# Altium project ESE516_Shipwars.PrjPcb (part 1 of 2)
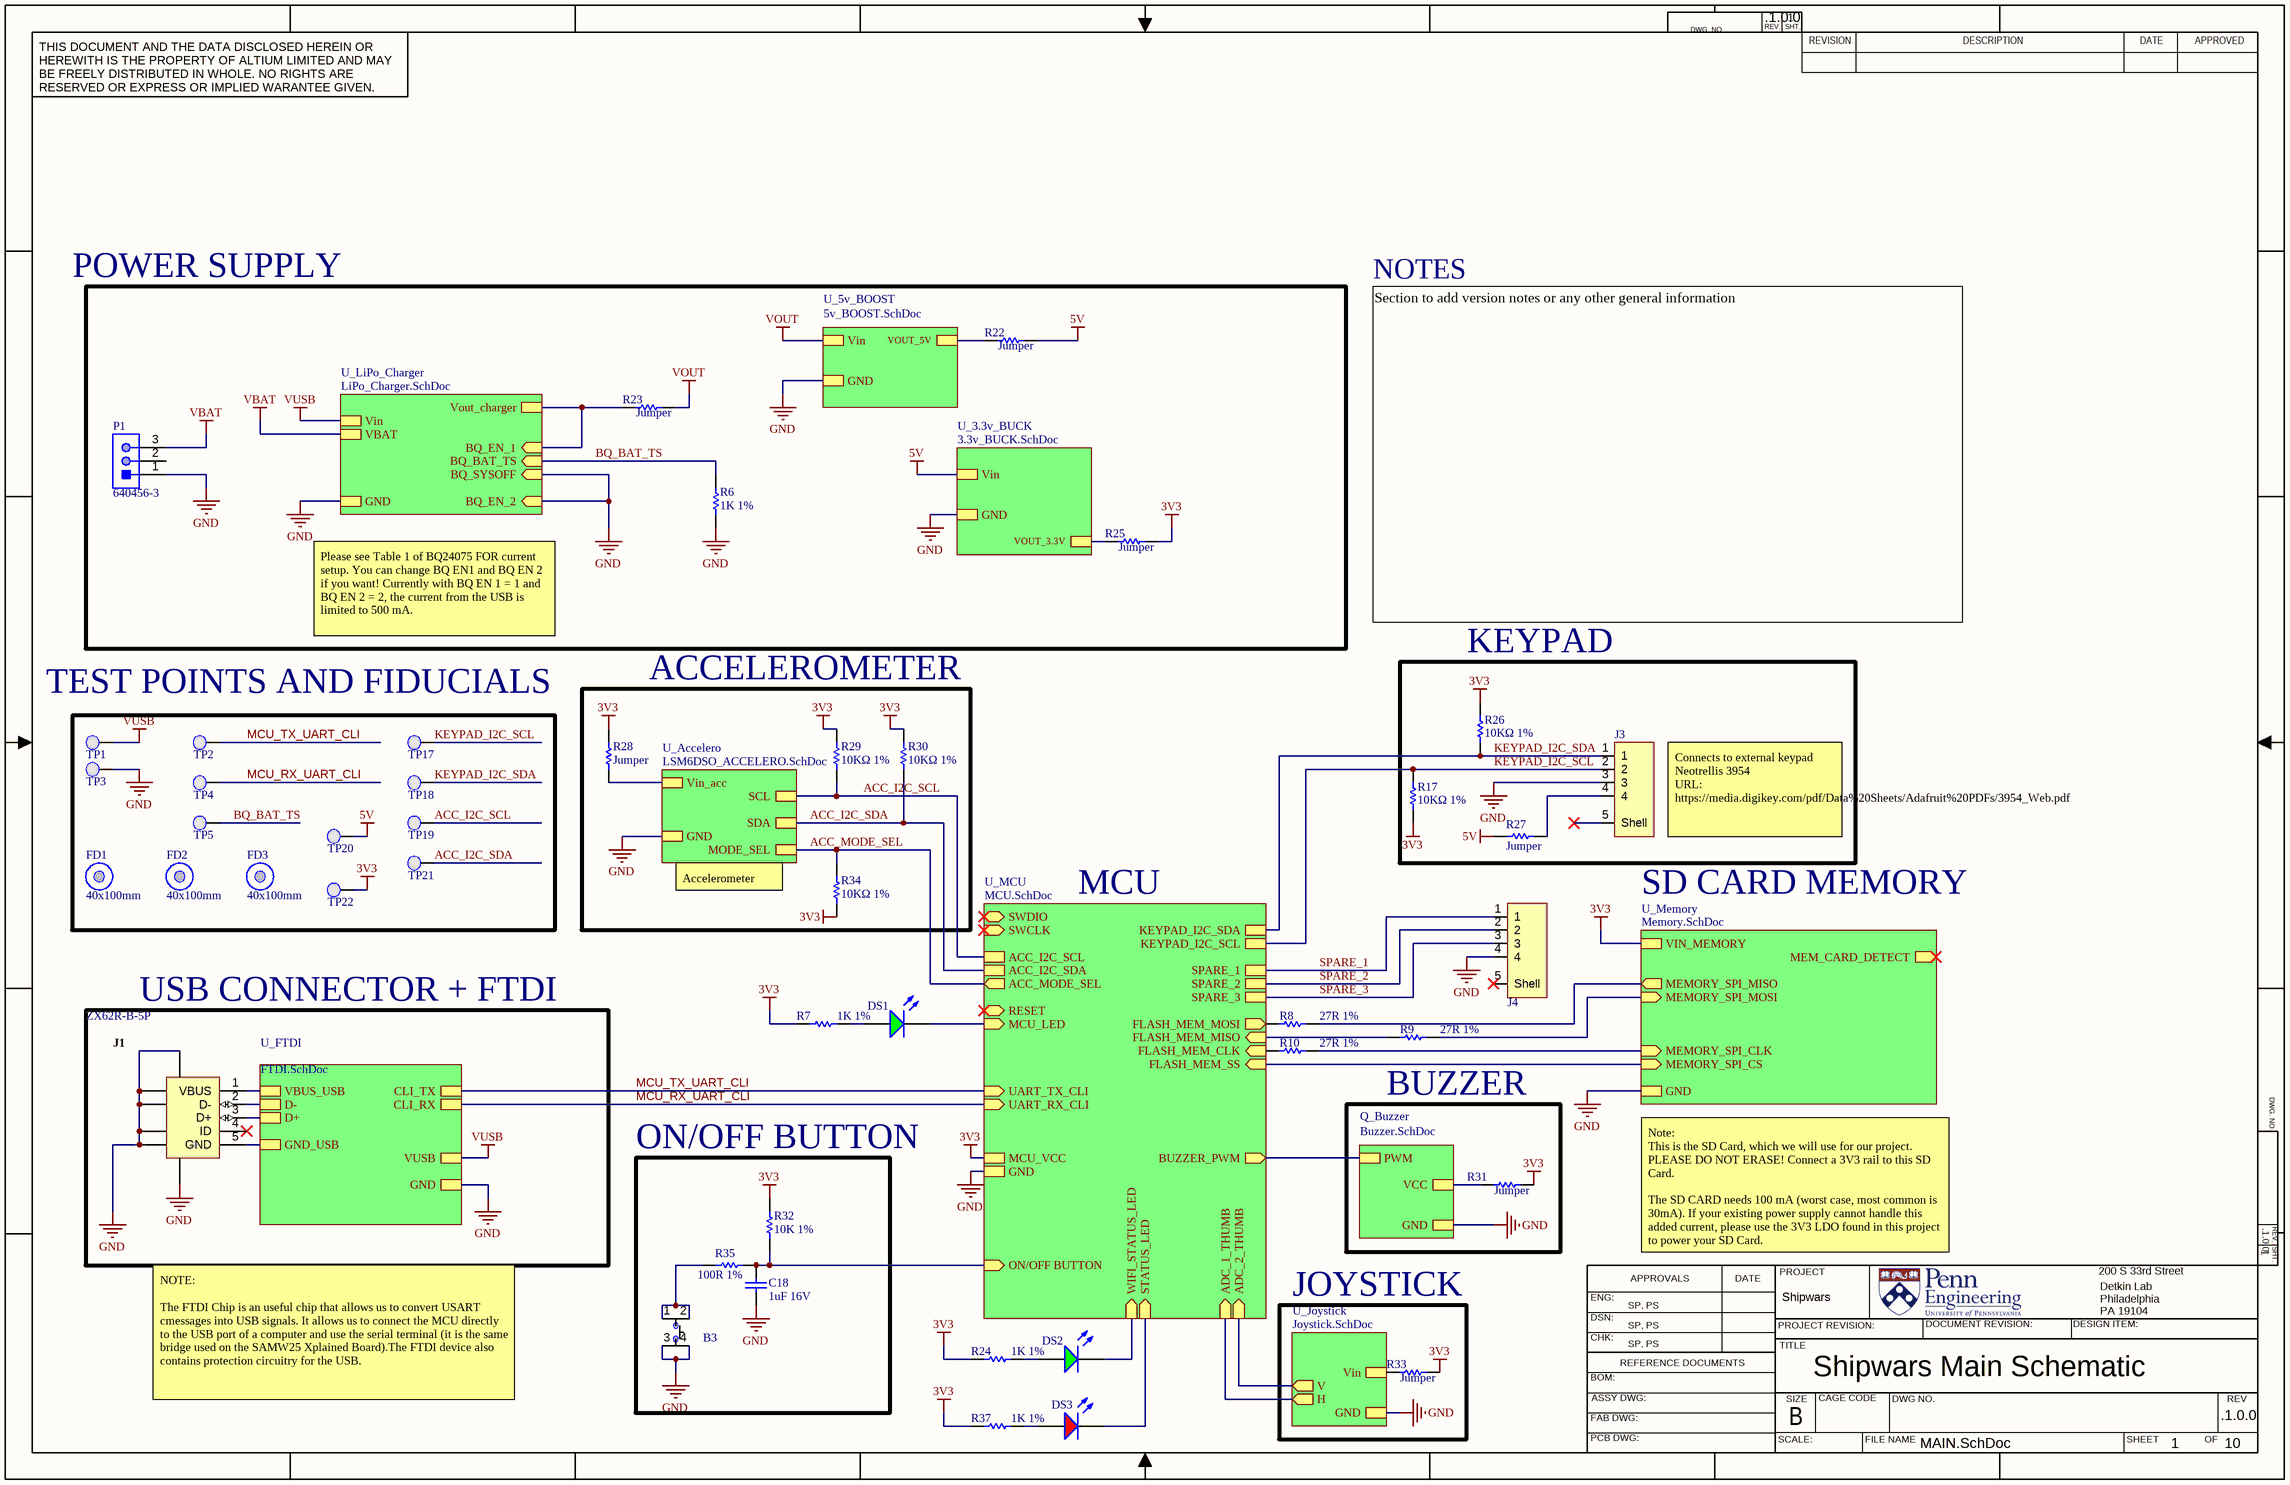
[diagram p0: MAIN.SchDoc]
10 sheets, 121 parts. Net scope: strictly hierarchical (ports join the sheet entries above them; power ports are local).
Board file: ESE516_shipwars_PCB.PcbDoc
Sheets:
  MAIN.SchDoc
    U_FTDI = FTDI.SchDoc
    U_MCU = MCU.SchDoc
    U_Memory = Memory.SchDoc
    U_LiPo_Charger = LiPo_Charger.SchDoc
    U_5v_BOOST = 5v_BOOST.SchDoc
    U_3.3v_BUCK = 3.3v_BUCK.SchDoc
    U_Accelero = LSM6DSO_ACCELERO.SchDoc
    U_Joystick = Joystick.SchDoc
    Q_Buzzer = Buzzer.SchDoc

## Sheet MAIN.SchDoc: Shipwars Main Schematic
size 431 x 279 mm; Date: 02/14/2022; CheckedBy: SP, PS; Author: SP, PS; CompanyName: UPenn; DrawnBy: SP, PS; Engineer: SP, PS; Organization: UPenn; Address1: 200 S 33rd Street; Address2: Detkin Lab; Address3: Philadelphia; Address4: PA 19104; Revision: .1.0.0; SheetNumber: 1; SheetTotal: 10; Project: Shipwars; Time: 19:00

### Parts
B3  PTS810 SJK 250 SMTR LFS  [PTS810 SJK 250 SMTR LFS]  (value not drawn)
C18  1uF 16V  [CAPC0603(1608)100_N]
DS1  LTST-C170GKT  [LTST-C170GKT_V]  (value not drawn)
DS2  LTST-C170GKT  [LTST-C170GKT_V]  (value not drawn)
DS3  LTST-C170CKT  [LTST-C170CKT_V]  (value not drawn)
FD1  40x100mm  [Fiducial_FT]  (no BOM)
FD2  40x100mm  [Fiducial_FT]  (no BOM)
FD3  40x100mm  [Fiducial_FT]  (no BOM)
J1  ZX62R-B-5P  [HIRO-ZX62R-B-5P_V]
J3  S4B-PH-SM4-TB(LF)(SN)  [S4B-PH-SM4-TB(LF)(SN)]  (value not drawn)
J4  S4B-PH-SM4-TB(LF)(SN)  [S4B-PH-SM4-TB(LF)(SN)]  (value not drawn)
P1  640456-3  [TECO-640456-3]
R6  1K 1%  [RESC0603(1608)_N]
R7  1K 1%  [RESC0603(1608)_N]
R8  27R 1%  [RESC0603(1608)_N]
R9  27R 1%  [RESC0603(1608)_N]
R10  27R 1%  [RESC0603(1608)_N]
R17  10KΩ 1%  [RESC0603(1608)_N]
R22  Jumper  [RESC0603(1608)_N]
R23  Jumper  [RESC0603(1608)_N]
R24  1K 1%  [RESC0603(1608)_N]
R25  Jumper  [RESC0603(1608)_N]
R26  10KΩ 1%  [RESC0603(1608)_N]
R27  Jumper  [RESC0603(1608)_N]
R28  Jumper  [RESC0603(1608)_N]
R29  10KΩ 1%  [RESC0603(1608)_N]
R30  10KΩ 1%  [RESC0603(1608)_N]
R31  Jumper  [RESC0603(1608)_N]
R32  10K 1%  [RESC0603(1608)_N]
R33  Jumper  [RESC0603(1608)_N]
R34  10KΩ 1%  [RESC0603(1608)_N]
R35  100R 1%  [RESC0603(1608)_N]
R37  1K 1%  [RESC0603(1608)_N]
TP1  0.1" Pad  [PCBComponent]  (value not drawn)  (no BOM)
TP2  0.1" Pad  [PCBComponent]  (value not drawn)  (no BOM)
TP3  0.1" Pad  [PCBComponent]  (value not drawn)  (no BOM)
TP4  0.1" Pad  [PCBComponent]  (value not drawn)  (no BOM)
TP5  0.1" Pad  [PCBComponent]  (value not drawn)  (no BOM)
TP17  0.1" Pad  [PCBComponent]  (value not drawn)  (no BOM)
TP18  0.1" Pad  [PCBComponent]  (value not drawn)  (no BOM)
TP19  0.1" Pad  [PCBComponent]  (value not drawn)  (no BOM)
TP20  0.1" Pad  [PCBComponent]  (value not drawn)  (no BOM)
TP21  0.1" Pad  [PCBComponent]  (value not drawn)  (no BOM)
TP22  0.1" Pad  [PCBComponent]  (value not drawn)  (no BOM)

### Blocks framed on the sheet
ACCELEROMETER: R28-R30 R34
KEYPAD: J3 R17 R26 R27
USB CONNECTOR + FTDI: J1
BUZZER: R31
ON/OFF BUTTON: B3 C18 R32 R35
JOYSTICK: R33

### Sub-sheets
Q_Buzzer = Buzzer.SchDoc: PWM, VCC, GND
U_3.3v_BUCK = 3.3v_BUCK.SchDoc: Vin, GND, VOUT_3.3V
U_5v_BOOST = 5v_BOOST.SchDoc: Vin, GND, VOUT_5V
U_Accelero = LSM6DSO_ACCELERO.SchDoc: Vin_acc, GND, SCL, SDA, MODE_SEL
U_FTDI = FTDI.SchDoc: VUSB, GND, VBUS_USB, D-, D+, GND_USB, CLI_RX, CLI_TX
U_Joystick = Joystick.SchDoc: GND, Vin, V (out), H (out)
U_LiPo_Charger = LiPo_Charger.SchDoc: BQ_EN_2 (in), BQ_SYSOFF (in), BQ_EN_1 (in), BQ_BAT_TS (in), Vin, GND, VBAT, Vout_charger
U_MCU = MCU.SchDoc: SWDIO (bidir), SWCLK (in), FLASH_MEM_SS (in), FLASH_MEM_CLK (in), FLASH_MEM_MISO (in), FLASH_MEM_MOSI (out), RESET (bidir), MCU_LED (in), MCU_VCC, KEYPAD_I2C_SCL, KEYPAD_I2C_SDA, UART_TX_CLI (in), UART_RX_CLI (in), GND, ON/OFF BUTTON (in), ADC_1_THUMB (in), ADC_2_THUMB (in), BUZZER_PWM (out), ACC_MODE_SEL (out), WIFI_STATUS_LED (in), STATUS_LED (in), SPARE_1, SPARE_2, SPARE_3, ACC_I2C_SCL, ACC_I2C_SDA
U_Memory = Memory.SchDoc: MEMORY_SPI_MOSI (in), MEMORY_SPI_MISO (out), MEMORY_SPI_CLK (in), MEMORY_SPI_CS (in), MEM_CARD_DETECT (out), VIN_MEMORY, GND

### Nets
3V3: R7.1 R17.2 R24.1 R25.2 R26.2 R28.2 R29.2 R30.2 R31.2 R32.2 R33.2 R34.1 R37.1 TP22.1(PAD) ; sheet U_MCU/MCU_VCC, sheet U_Memory/VIN_MEMORY
5V: R22.2 R27.2 TP20.1(PAD) ; sheet U_3.3v_BUCK/Vin
GND: B3.3 B3.4 C18.1 J1.5(GND) J1.6(SHLD) J1.7(SHLD) J1.8(SHLD) J1.9(SHLD) J1.10(SHLD) J1.11(SHLD) J3.3 J4.4 P1.1 R6.2 TP3.1(PAD) ; sheet U_FTDI/GND, sheet U_FTDI/GND_USB, sheet U_MCU/GND, sheet U_Memory/GND, sheet U_LiPo_Charger/BQ_EN_2, sheet U_LiPo_Charger/BQ_SYSOFF, sheet U_LiPo_Charger/GND, sheet U_5v_BOOST/GND, sheet U_3.3v_BUCK/GND, sheet U_Accelero/GND, sheet U_Joystick/GND, sheet Q_Buzzer/GND
VBAT: P1.3 ; sheet U_LiPo_Charger/VBAT
VBUS: J1.1(VBUS) ; sheet U_FTDI/VBUS_USB
Vin_acc: R28.1 ; sheet U_Accelero/Vin_acc
VOUT: R23.2 ; sheet U_5v_BOOST/Vin
Vout_BQ: R23.1 ; sheet U_LiPo_Charger/BQ_EN_1, sheet U_LiPo_Charger/Vout_charger
VOUT_BUCK: R25.1 ; sheet U_3.3v_BUCK/VOUT_3.3V
VUSB: TP1.1(PAD) ; sheet U_FTDI/VUSB, sheet U_LiPo_Charger/Vin
ACC_I2C_SCL: R29.1 TP19.1(PAD) ; sheet U_MCU/ACC_I2C_SCL, sheet U_Accelero/SCL
ACC_I2C_SDA: R30.1 TP21.1(PAD) ; sheet U_MCU/ACC_I2C_SDA, sheet U_Accelero/SDA
ACC_MODE_SEL: R34.2 ; sheet U_MCU/ACC_MODE_SEL, sheet U_Accelero/MODE_SEL
ADC_1_THUMBSTICK: sheet U_MCU/ADC_1_THUMB, sheet U_Joystick/H
ADC_2_THUMBSTICK: sheet U_MCU/ADC_2_THUMB, sheet U_Joystick/V
BQ_BAT_TS: R6.1 TP5.1(PAD) ; sheet U_LiPo_Charger/BQ_BAT_TS
FLASH_MEM_SPI_SS: sheet U_MCU/FLASH_MEM_SS, sheet U_Memory/MEMORY_SPI_CS
KEYPAD_I2C_SCL: J3.2 R17.1 TP17.1(PAD) ; sheet U_MCU/KEYPAD_I2C_SCL
KEYPAD_I2C_SDA: J3.1 R26.1 TP18.1(PAD) ; sheet U_MCU/KEYPAD_I2C_SDA
MCU_LED: DS1.2(K) ; sheet U_MCU/MCU_LED
MCU_RX_UART_CLI: TP4.1(PAD) ; sheet U_FTDI/CLI_RX, sheet U_MCU/UART_RX_CLI
MCU_TX_UART_CLI: TP2.1(PAD) ; sheet U_FTDI/CLI_TX, sheet U_MCU/UART_TX_CLI
MEM_SPI_CLK: R10.2 ; sheet U_Memory/MEMORY_SPI_CLK
MEM_SPI_MISO: R8.2 ; sheet U_Memory/MEMORY_SPI_MISO
MEM_SPI_MOSI: R9.2 ; sheet U_Memory/MEMORY_SPI_MOSI
ON/OFF_BUTTON: C18.2 R32.1 R35.2 ; sheet U_MCU/ON/OFF BUTTON
PWM: sheet U_MCU/BUZZER_PWM, sheet Q_Buzzer/PWM
SERCOM1_PAD2_SPI_MISO: R9.1 ; sheet U_MCU/FLASH_MEM_MISO
SERCOM1_PAD2_SPI_MOSI: R8.1 ; sheet U_MCU/FLASH_MEM_MOSI
SERCOM1_PAD3_SPI_SCK: R10.1 ; sheet U_MCU/FLASH_MEM_CLK
SPARE_1: J4.1 ; sheet U_MCU/SPARE_1
SPARE_2: J4.2 ; sheet U_MCU/SPARE_2
SPARE_3: J4.3 ; sheet U_MCU/SPARE_3
STATUS_LED: DS3.2(K) ; sheet U_MCU/STATUS_LED
USB_DATA_N: J1.2(D-) ; sheet U_FTDI/D-
USB_DATA_P: J1.3(D+) ; sheet U_FTDI/D+
VCC: R31.1 ; sheet Q_Buzzer/VCC
Vin: R33.1 ; sheet U_Joystick/Vin
VOUT_5V: R22.1 ; sheet U_5v_BOOST/VOUT_5V
WIFI_STATUS_LED: DS2.2(K) ; sheet U_MCU/WIFI_STATUS_LED
NetB3_1: B3.1 B3.2 R35.1
NetDS1_1: DS1.1(A) R7.2
NetDS2_1: DS2.1(A) R24.2
NetDS3_1: DS3.1(A) R37.2
NetJ3_4: J3.4 R27.1

Not connected (* = marked no-connect by the designer): J1 4(ID)*; J3 5(Shell)*; J4 5(Shell)*; P1 2

### Notes on the sheet
- POWER SUPPLY
- NOTES
- Please see Table 1 of BQ24075 FOR current setup. You can change BQ EN1 and BQ EN 2 if you want! Currently with BQ EN 1 = 1 and BQ EN 2 = 2, the current from the USB is limited to 500 mA.
- Section to add version notes or any other general information
- TEST POINTS AND FIDUCIALS
- Connects to external keypad Neotrellis 3954
  URL: https://media.digikey.com/pdf/Data%20Sheets/Adafruit%20PDFs/3954_Web.pdf
- Accelerometer
- MCU
- (near J3) SD CARD MEMORY
- Note:
  This is the SD Card, which we will use for our project. PLEASE DO NOT ERASE! Connect a 3V3 rail to this SD Card.
  The SD CARD needs 100 mA (worst case, most common is 30mA). If your existing power supply cannot handle this added current, please use the 3V3 LDO found in this project to power your SD Card.
- NOTE:
  The FTDI Chip is an useful chip that allows us to convert USART cmessages into USB signals. It allows us to connect the MCU directly to the USB port of a computer and use the serial terminal (it is the same bridge used on the SAMW25 Xplained Board).The FTDI device also contains protection circuitry for the USB.
- DWG. NO.
- REV.
- SHT.
- THIS DOCUMENT AND THE DATA DISCLOSED HEREIN OR HEREWITH IS THE PROPERTY OF ALTIUM LIMITED AND MAY BE FREELY DISTRIBUTED IN WHOLE. NO RIGHTS ARE RESERVED OR EXPRESS OR IMPLIED WARANTEE GIVEN.
- REVISION
- DESCRIPTION
- DATE
- APPROVED
- ENG:
- APPROVALS
- PROJECT
- DSN:
- CHK:
- REFERENCE DOCUMENTS
- PROJECT REVISION:
- TITLE
- DOCUMENT REVISION:
- DESIGN ITEM:
- BOM:
- FAB DWG:
- PCB DWG:
- ASSY DWG:
- SCALE:
- SIZE
- B
- CAGE CODE
- FILE NAME
- DWG NO.
- SHEET
- OF
- REV

### Library data of the parts
B3 = PTS810 SJK 250 SMTR LFS: SWITCH TACTILE SPST-NO 0.05A 16V Tactile Switch SPST-NO Top Actuated Surface Mount; Manufacturer: ITT /  C&K Components; Part # Aliases: Y97LT25B5DBFP; Operating Force: 2.6 N; Actuator: Oval; Current Rating: 50 mA; Voltage Rating DC: 16 VDC; Contact Form: SPST; Switch Function: OFF - (ON); Mounting Direction: Straight; Stem Height: 2.5 mm; Brand: C&K Components; Travel: 0.15 mm; Manufacturer Part Number: PTS810SJK250SMTRLFS; Product Category: Tactile Switches; RoHS: Details; Termination Style: J Form Lead; Mounting Style: SMD/SMT; Color: White; Packaging: Reel; Contact Plating: Silver; Operating Temperature Range: - 40 C to + 85 C; Series: PTS810; Factory Pack Quantity: 2900; ComponentLink1URL: https://datasheet.ciiva.com/18514/pts810-4mar13-18514061.pdf; ComponentLink1Description: https://datasheet.ciiva.com/18514/pts810-4mar13-18514061.pdf; ComponentLink2URL: https://datasheet.ciiva.com/18514/pts810-4mar13-18514062.pdf; ComponentLink2Description: https://datasheet.ciiva.com/18514/pts810-4mar13-18514062.pdf; ComponentLink3URL: https://datasheet.ciiva.com/18514/pts810-4mar13-18514063.pdf; ComponentLink3Description: https://datasheet.ciiva.com/18514/pts810-4mar13-18514063.pdf; Supplier 1: Digi-Key; Supplier Part Number 1: CKN10503CT-ND
C18 = CMP-1035-02736-1: CAP 1uF 16V ±5% 0603 (1608 Metric) Thickness 1mm SMD; Case-Metric: 1608; Case-EIA: 0603; Tolerance: Â±5%; Technology: SMT; Max Thickness: 1 mm; Rated Voltage: 16 V; Value: 1uF
DS1 DS2 = CMP-1674-00002-5: LED Uni-Color Green, 100 mW, 120 mA, -55 to 85 degC, 2-Pin SMD, RoHS, Tape and Reel; Manufacturer: Lite-On; PackageReference: C170GKT; ComponentLink1Description: Manufacturer URL; ComponentLink1URL: http://www.us.liteon.com/; Height: 1.1 mm; PackageDescription: 2-Pin Surface Mount Device, Body 2 x 1.25 mm; RoHSCompliant: true; Package Quantity: 1; Packaging: Tape and Reel; Mount: Surface Mount; Min Operating Temperature: -55 degC; DatasheetVersion: 03/2003; Max Operating Temperature: 85 degC; Pins: 2; Mounting Technology: Surface Mount; Length: 2 mm; Colour: Green; ComponentLink2URL: http://media.digikey.com/pdf/Data%20Sheets/Lite-On%20PDFs/LTST-C170GKT.pdf; ComponentLink2Description: Datasheet
DS3 = CMP-1674-00001-5: LED Uni-Color Red, 100 mW, 200 mA, -55 to 85 degC, 2-Pin SMD, RoHS, Tape and Reel; Manufacturer: Lite-On; PackageReference: C170CKT; ComponentLink1Description: Manufacturer URL; ComponentLink1URL: http://www.us.liteon.com/; Package Quantity: 3000; Packaging: Tape and Reel; Pins: 2; ComponentLink2URL: http://media.digikey.com/pdf/Data%20Sheets/Lite-On%20PDFs/LTST-C170CKT.pdf; Max Operating Temperature: 85 degC; Min Operating Temperature: -55 degC; Mounting Technology: Surface Mount; Mount: Surface Mount; Length: 2 mm; ComponentLink2Description: Datasheet; DatasheetVersion: 03/2003; Height: 1.1 mm; PackageDescription: 2-Pin Surface Mount Device, Body 2 x 1.25 mm; RoHSCompliant: true; Colour: Red
FD1-FD3 = CMP-00174-A.4: Fiducial 40x100mm
J1 = CMP-0031-00001-1: Connector; USBMicro-B,Reverse type, SMT; 5 Position; Right Angle; DatasheetVersion: 08/2010; Operating Temperature: -30 to 85 degC; Mounting Technology: Surface Mount; PartNumber: ZX62R-B-5P; PackageReference: ZX62R-B-5P; ComponentLink2URL: http://www.hirose.co.jp/cataloge_hp/e24200011.pdf; ComponentLink1URL: http://www.hirose.com/â€Ž; ComponentLink2Description: Datasheet; PackageDescription: 5-Pin USB Micro-B R/A Connector; ComponentLink1Description: Manufacturer URL
J3 J4 = S4B-PH-SM4-TB(LF)(SN): JST (JAPAN SOLDERLESS TERMINALS) - S4B-PH-SM4-TB(LF)(SN) - Wire-To-Board Connector, 2 mm, 4 Contacts, Header, PH Series, Surface Mount, 1 Rows; Number of Positions: 4; Insulation Resistance: 1GR; Gender: Male; Current Rating: 2A; Voltage Rating: 100V; Connector Type: Header,Male Pin; Contact Resistance: 20mR; Pitch: 2mm; Supplier 1: Newark; Manufacturer: JST; Manufacturer Part Number: S4B-PH-SM4-TB(LF)(SN); RoHS: Yes; Category: Connectors; Mount: Surface Mount; Housing Material: Polyamide; Color: Natural,White; Contact Material: Copper Alloy,Tin,Bronze,Brass; Contact Plating: Tin,Copper; Housing Color: Beige; Contact Shape: Square; Insulation Material: Nylon; Insulation Color: Natural; Min Operating Temperature: -25°C; Max Operating Temperature: 85°C; Termination: Solder; Number of Contacts: 4; Number of Rows: 1; Packaging: Tape and Reel; Voltage Rating (AC): 100V; Orientation: Right Angle; Fastening Type: Detent; Working Voltage: 100V; Max Voltage Rating (AC): 100V; Max Voltage Rating (DC): 100V; Number of Poles: 4; Max Current Rating: 2A; Length: 11.9mm; Width: 5mm; Height: 9.4mm; Contact Mating Length: 0.13inch; Depth: 7.6mm; Lead Pitch: 2mm; Lead Free: Lead Free; REACH SVHC: No SVHC; Flammability Rating: UL94 V-0; ComponentLink1URL: https://datasheet.ciiva.com/11746/0900766b80df0d9d-11746552.pdf?src-supplier=RSComponents; ComponentLink1Description: https://datasheet.ciiva.com/11746/0900766b80df0d9d-11746552.pdf?src-supplier=RSComponents; ComponentLink2URL: https://datasheet.ciiva.com/712/eph-712578.pdf?src-supplier=Digi-Key; ComponentLink2Description: https://datasheet.ciiva.com/712/eph-712578.pdf?src-supplier=Digi-Key; ComponentLink3URL: https://datasheet.ciiva.com/712/eph-712579.pdf?src-supplier=Digi-Key; ComponentLink3Description: https://datasheet.ciiva.com/712/eph-712579.pdf?src-supplier=Digi-Key; ComponentLink4URL: https://datasheet.ciiva.com/730/eph-730675.pdf?src-supplier=Digi-Key; ComponentLink4Description: https://datasheet.ciiva.com/730/eph-730675.pdf?src-supplier=Digi-Key; ComponentLink5URL: https://datasheet.ciiva.com/8052/1699381-8052234.pdf?src-supplier=Element14; ComponentLink5Description: https://datasheet.ciiva.com/8052/1699381-8052234.pdf?src-supplier=Element14; ComponentLink6URL: https://datasheet.ciiva.com/26894/getdatasheetpartid-639990-26894620.pdf?src-supplier=Verical; ComponentLink6Description: https://datasheet.ciiva.com/26894/getdatasheetpartid-639990-26894620.pdf?src-supplier=Verical; ComponentLink7URL: https://datasheet.ciiva.com/16376/eph-16376783.pdf?src-supplier=Future+Electronics; ComponentLink7Description: https://datasheet.ciiva.com/16376/eph-16376783.pdf?src-supplier=Future+Electronics; Supplier Part Number 1: 38K8075
P1 = CMP-2000-05418-1: Male Header, Pitch 2.54 mm, 1 x 3 Position, Height 10.03 mm, Tail Length 3.56 mm, -55 to 105 degC; Manufacturer: TE Connectivity; Agency Approvals: CSA,UL; Angle: Straight; Number of Positions: 3; Standards: RoHSCompliant,ELVCompliant,UL94V-0; Current, Rating: 5 / A; Connector Type: MTA-100; Mount Angle: Vertical; Material, Housing: Polyester; Temperature, Operating: -55to+105 / degC; Voltage, Rating: 250 / V; Color, Housing: White; Contact Centerline Spacing: 0.100 / in.; Special Features: Pinstrip; Material, Contact: CopperAlloy; Contact Termination Area Plating: Tin; Primary Type: InterconnectSystem; Pin Spacing: 0.1 / "; Brand/Series: MTA-100Series; Mounting Hole Size: 0.04 / "; Manufacturer URL: http://www.te.com/; Datasheet URL: https://datasheet.ciiva.com/16456/eng-ds-82056-mta-0608-16456886.pdf; Flammability Rating: UL94V-0; Mounting Type: PCMount; Contact Mating Area Plating: Tin; Datasheet Version: Jun-08; Number of Rows: 1; Termination: Solder; Type: PCBPlug; Length, Pin: 0.14 / "; Color: White; Contact Plating: Tin; Contact Shape: Square; Number of Contacts: 3; Size, Post: 0.025 / in.; Length, Terminal Post: 0.14 / in.; Length, Overall: 0.3 / "
R6 R7 R24 R37 = CMP-1012-00510-1: 1K 0.1W 1% 0603 (1608 Metric)  SMD; Case-Metric: 1608; Case-EIA: 0603; Value: 1000.00 Ohm; Technology: SMT; Tolerance: 1 %; Power: 0.1 W
R8-R10 = CMP-1012-00331-1: 27R 0.1W 1% 0603 (1608 Metric)  SMD; Case-EIA: 0603; Value: 27.00 Ohm; Case-Metric: 1608; Technology: SMT; Tolerance: 1 %; Power: 0.1 W
R17 R26 R29 R30 R32 R34 = CMP-1012-00623-1: 10K 0.1W 1% 0603 (1608 Metric)  SMD; Value: 10000.00 Ohm; Case-EIA: 0603; Case-Metric: 1608; Power: 0.1 W; Tolerance: 1 %; Technology: SMT
R22 R23 R25 R27 R28 R31 R33 = CMP-1012-00001-1: Jumper 0603 (1608 Metric); Case-Metric: 1608; Value: 0.00 Ohm; Power: None; Case-EIA: 0603; Technology: SMT; Tolerance: None
R35 = CMP-1012-00397-1: 100R 0.1W 1% 0603 (1608 Metric)  SMD; Value: 100.00 Ohm; Case-EIA: 0603; Case-Metric: 1608; Technology: SMT; Tolerance: 1 %; Power: 0.1 W
TP1-TP5 TP17-TP22 = 0.1" Pad-A.4

## Sheet FTDI.SchDoc: Shipwars FTDI Schematic
size 431 x 279 mm; CheckedBy: SP, PS; Author: SP, PS; CompanyName: UPenn; DrawnBy: SP, PS; Engineer: SP, PS; Organization: UPenn; Address1: 200 S 33rd Street; Address2: Detkin Lab; Address3: Philadelphia; Address4: PA 19104; Revision: .1.0.0; SheetNumber: 4; SheetTotal: 10; Project: Shipwars
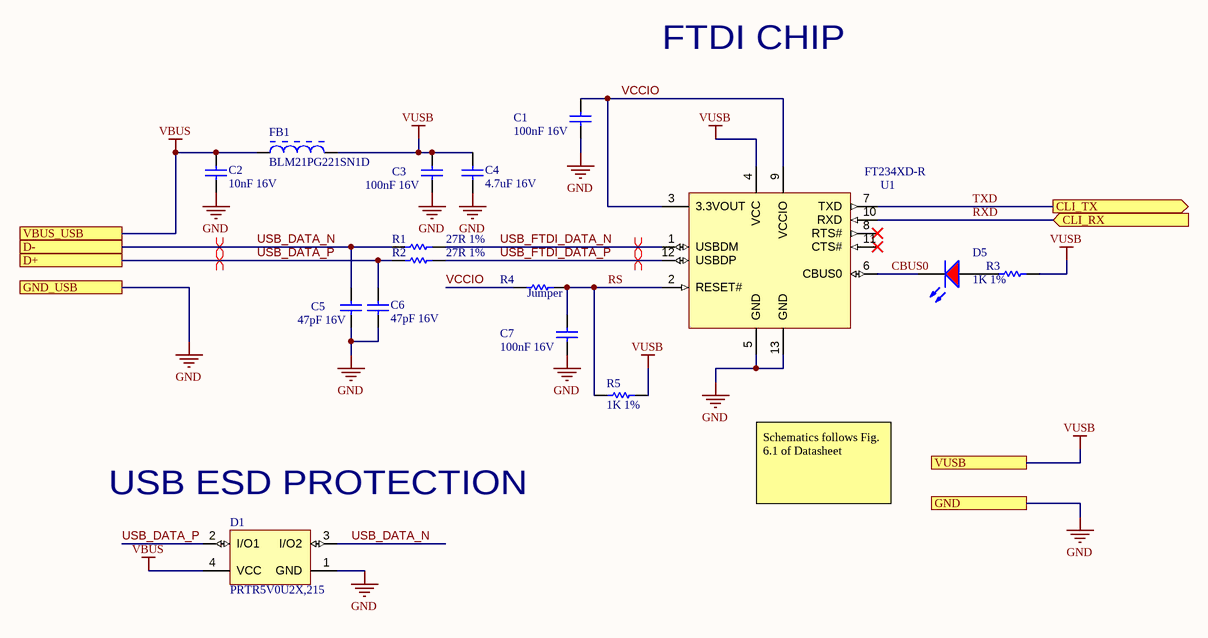
[diagram p1: FTDI.SchDoc]

### Parts
C1  100nF 16V  [CAPC0603(1608)100_N]
C2  10nF 16V  [CAPC0603(1608)100_N]
C3  100nF 16V  [CAPC0603(1608)100_N]
C4  4.7uF 16V  [CAPC0805(2012)145_N]
C5  47pF 16V  [CAPC0603(1608)100_N]
C6  47pF 16V  [CAPC0603(1608)100_N]
C7  100nF 16V  [CAPC0603(1608)100_N]
D1  PRTR5V0U2X,215  [NXP-SOT143B-4_V]
D5  LTST-C170CKT  [LTST-C170CKT_V]  (value not drawn)
FB1  BLM21PG221SN1D  [MURA-BLM21-B20-CHIP-2_V2]
R1  27R 1%  [RESC0603(1608)_N]
R2  27R 1%  [RESC0603(1608)_N]
R3  1K 1%  [RESC0603(1608)_N]
R4  Jumper  [RESC0603(1608)_N]
R5  1K 1%  [RESC0603(1608)_N]
U1  FT234XD-R  [DFN-12_V]

### Ports
CLI_RX (in), CLI_TX (out), D+, D-, GND, GND_USB, VBUS_USB, VUSB

### Nets
GND: C1.1 C2.1 C3.1 C4.1 C5.1 C6.1 C7.1 D1.1(GND) U1.5(GND) U1.13(GND) ; port GND, port GND_USB
VBUS: C2.2 D1.4(VCC) FB1.1 ; port VBUS_USB
VUSB: C3.2 C4.2 FB1.2 R3.2 R5.1 U1.4(VCC) ; port VUSB
CBUS0: D5.2(K) U1.6(CBUS0)
RS: C7.2 R4.2 R5.2 U1.2(RESET#)
RXD: U1.10(RXD) ; port CLI_RX  [project net MCU_RX_UART_CLI]
TXD: U1.7(TXD) ; port CLI_TX  [project net MCU_TX_UART_CLI]
USB_DATA_N: C5.2 D1.3(I/O2) R1.1 ; port D-
USB_DATA_P: C6.2 D1.2(I/O1) R2.1 ; port D+
USB_FTDI_DATA_N: R1.2 U1.1(USBDM)
USB_FTDI_DATA_P: R2.2 U1.12(USBDP)
VCCIO: C1.2 R4.1 U1.3(3.3VOUT) U1.9(VCCIO)
NetD5_1: D5.1(A) R3.1

Not connected (* = marked no-connect by the designer): U1 8(RTS#)* 11(CTS#)*

### Layout directives
differential pair: USB_DATA_N, USB_DATA_P, USB_FTDI_DATA_N, USB_FTDI_DATA_P

### Notes on the sheet
- FTDI CHIP
- (near D1) USB ESD PROTECTION
- Schematics follows Fig. 6.1 of Datasheet
- DWG. NO.
- REV.
- SHT.
- THIS DOCUMENT AND THE DATA DISCLOSED HEREIN OR HEREWITH IS THE PROPERTY OF ALTIUM LIMITED AND MAY BE FREELY DISTRIBUTED IN WHOLE. NO RIGHTS ARE RESERVED OR EXPRESS OR IMPLIED WARANTEE GIVEN.
- REVISION
- DESCRIPTION
- DATE
- APPROVED
- ENG:
- APPROVALS
- PROJECT
- DSN:
- CHK:
- REFERENCE DOCUMENTS
- PROJECT REVISION:
- TITLE
- DOCUMENT REVISION:
- DESIGN ITEM:
- BOM:
- FAB DWG:
- PCB DWG:
- ASSY DWG:
- SCALE:
- SIZE
- B
- CAGE CODE
- FILE NAME
- DWG NO.
- SHEET
- OF
- REV

### Library data of the parts
C1 C3 C7 = CMP-1035-02584-1: CAP 100nF 16V ±10% 0603 (1608 Metric) Thickness 1mm SMD; Tolerance: Â±10%; Case-EIA: 0603; Case-Metric: 1608; Technology: SMT; Max Thickness: 1 mm; Value: 100nF; Rated Voltage: 16 V
C2 = CMP-1035-02311-1: CAP 10nF 16V ±10% 0603 (1608 Metric) Thickness 1mm SMD; Case-EIA: 0603; Case-Metric: 1608; Tolerance: Â±10%; Rated Voltage: 16 V; Value: 10nF; Max Thickness: 1 mm; Technology: SMT
C4 = CMP-1036-04893-1: CAP 4.7uF 16V -20% to +80% 0805 (2012 Metric) Thickness 1.45mm SMD; Case-Metric: 2012; Case-EIA: 0805; Max Thickness: 1.45 mm; Value: 4.7uF; Rated Voltage: 16 V; Tolerance: -20% to +80%; Technology: SMT
C5 C6 = CMP-1035-01048-1: CAP 47pF 16V ±0.5pF 0603 (1608 Metric) Thickness 1mm SMD; Case-EIA: 0603; Case-Metric: 1608; Tolerance: Â±0.5pF; Technology: SMT; Value: 47pF; Rated Voltage: 16 V; Max Thickness: 1 mm
D1 = CMP-2000-05285-1: Ultra Low Capacitance Double Rail-to-Rail ESD Protection Diode, 5.5 V, 1 pF, -40 to 85 degC, 4-Pin SOT143B, RoHS, Tape and Reel; Manufacturer: NXP Semiconductors; Capacitance Value: 16pF; Number of Elements: 1; Rad Hardened: No; Reverse Breakdown Voltage: 6V; Working Voltage (Max): 5.5V; Polarity: Uni-Directional; Configuration: Quad; Leakage Current: 0.1uA; Product Height (mm): 1mm; Suppressor Type: DiodeArrays; Product Length (mm): 3mm; Product Depth (mm): 1.4mm; ESD Protection Voltage: 8KV@ContactDisc; Package Type: SOT; Mounting: SurfaceMount; Packaging: TapeandReel; Datasheet Version: Rev. 02, 01/2008; Reverse Stand-off Voltage: 5.5V; Manufacturer URL: http://www.nxp.com/; Operating Temp Range: -40Cto85C; Operating Temperature Classification: Industrial; Working Voltage: 5.5V; Operating Temperature Min Deg. C: -40C; Datasheet URL: https://datasheet.ciiva.com/4479/prtr5v0u2x-102853-4479461.pdf; Leakage Current (Max): 0.1uA; Direction Type: Uni-Directional; Pin Count: 3+Tab; Operating Temperature Max Deg. C: 85C; Mounting Style: SurfaceMount; Package / Case: SOT
D5 = CMP-1674-00001-5: as DS3 on sheet MAIN; PackageReference: C170CKT; ComponentLink1Description: Manufacturer URL; ComponentLink1URL: http://www.us.liteon.com/; Package Quantity: 3000; Packaging: Tape and Reel; Pins: 2; ComponentLink2URL: http://media.digikey.com/pdf/Data%20Sheets/Lite-On%20PDFs/LTST-C170CKT.pdf; Max Operating Temperature: 85 degC; Min Operating Temperature: -55 degC; Mounting Technology: Surface Mount; Mount: Surface Mount; Length: 2 mm; ComponentLink2Description: Datasheet; DatasheetVersion: 03/2003; Height: 1.1 mm; PackageDescription: 2-Pin Surface Mount Device, Body 2 x 1.25 mm; RoHSCompliant: true; Colour: Red
FB1 = CMP-0686-00610-2: Chip Ferrite Bead for Power Lines, 220 Ohm, 2000 mA, -55 to 125 degC, 2 x 1.25 x 1.05 mm SMD, Tape and Reel; Manufacturer: Murata; DC Resistance: 0.045 Ohm Max.; Impedance (at 100 MHz): 220 Ohm +/- 25%; Rated Current: 2000 mA; PartNumber: BLM21PG221SN1D; Mounting Technology: Surface Mount; DatasheetVersion: 08/2013; ComponentLink3URL: http://www.murata.com/products/catalog/pdf/c31e.pdf; ComponentLink1URL: http://www.murata.com/; ComponentLink1Description: Manufacturer URL; ComponentLink2URL: http://www.murata.com/products/catalog/pdf/c31e.pdf; PackageDescription: 2-Pin Chip, Body 2 x 1.25 mm; ComponentLink3Description: Package Specification; Operating Temperature Range: -55 to 125 degC; Packing: Tape and Reel; ComponentLink2Description: Datasheet; PackageReference: BLM21_H1050-2
R1 R2 = CMP-1012-00331-1: as R8 on sheet MAIN; Technology: SMT; Tolerance: 1 %; Power: 0.1 W
R3 R5 = CMP-1012-00510-1: as R6 on sheet MAIN; Technology: SMT; Tolerance: 1 %; Power: 0.1 W
R4 = CMP-1012-00001-1: as R22 on sheet MAIN; Technology: SMT; Tolerance: None
U1 = CMP-0248-00027-1: FT234XD USB to BASIC UART IC, -40 to +85 degC, 12-Pin DFN, Pb-Free, Tape and Reel; Manufacturer: FTDI; PackageReference: DFN-12; PackageVersion: Feb-13; DatasheetVersion: ver 1.1, Feb-2013; ComponentLink1URL: http://www.ftdichip.com/; PartNumber: FT234XD-R; ComponentLink2URL: http://www.ftdichip.com/Support/Documents/DataSheets/ICs/DS_FT234XD.pdf; ComponentLink1Description: Manufacturer URL; PackageDescription: 12-Pin Dual Flat No-Lead, 3 x 3 mm Body, 0.45 mm Pitch, Exposed Pad; ComponentLink2Description: Datasheet

## Sheet MCU.SchDoc: Shipwars MCU Schematic
size 431 x 279 mm; CheckedBy: SP, PS; Author: SP, PS; CompanyName: UPenn; DrawnBy: SP, PS; Engineer: SP, PS; Organization: UPenn; Address1: 200 S 33rd Street; Address2: Detkin Lab; Address3: Philadelphia; Address4: PA 19104; Revision: .1.0.0; SheetNumber: 3; SheetTotal: 10; Project: Shipwars
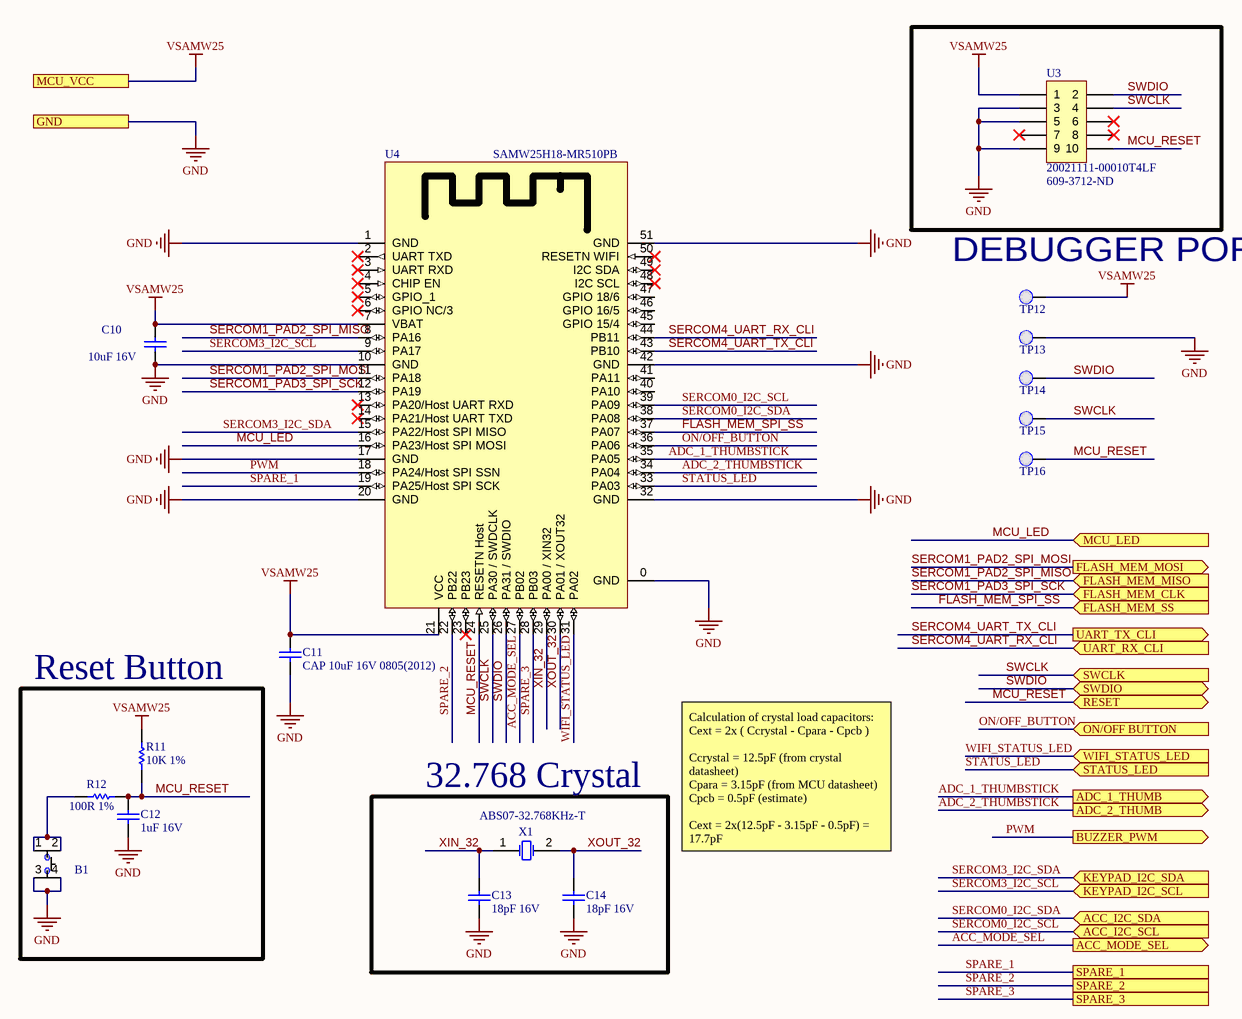
[diagram p2: MCU.SchDoc]

### Parts
B1  PTS810 SJK 250 SMTR LFS  [PTS810 SJK 250 SMTR LFS]  (value not drawn)
C10  10uF 16V  [CAPC0805(2012)145_N]
C11  CAP 10uF 16V 0805(2012)  [CAPC0805(2012)145_N]
C12  1uF 16V  [CAPC0603(1608)100_N]
C13  18pF 16V  [CAPC0603(1608)100_N]
C14  18pF 16V  [CAPC0603(1608)100_N]
R11  10K 1%  [RESC0603(1608)_N]
R12  100R 1%  [RESC0603(1608)_N]
TP12  0.1" Pad  [PCBComponent]  (value not drawn)  (no BOM)
TP13  0.1" Pad  [PCBComponent]  (value not drawn)  (no BOM)
TP14  0.1" Pad  [PCBComponent]  (value not drawn)  (no BOM)
TP15  0.1" Pad  [PCBComponent]  (value not drawn)  (no BOM)
TP16  0.1" Pad  [PCBComponent]  (value not drawn)  (no BOM)
U3  20021111-00010T4LF  Supplier Part Number 1: 609-3712-ND  [20021111-00010T4LF]
U4  SAMW25H18-MR510PB  [SAMW25H18-MR510PB]
X1  ABS07-32.768KHz-T  [ABRA-ABS07-2_V]

### Blocks framed on the sheet
Reset Button: B1 C12 R11 R12
32.768 Crystal: C13 C14 X1

### Ports
ACC_I2C_SCL (in), ACC_I2C_SDA (in), ACC_MODE_SEL (out), ADC_1_THUMB (out), ADC_2_THUMB (out), BUZZER_PWM (out), FLASH_MEM_CLK (in), FLASH_MEM_MISO (in), FLASH_MEM_MOSI (out), FLASH_MEM_SS (in), GND, KEYPAD_I2C_SCL (in), KEYPAD_I2C_SDA (in), MCU_LED (in), MCU_VCC, ON/OFF BUTTON (in), RESET (bidir), SPARE_1, SPARE_2, SPARE_3, STATUS_LED (in), SWCLK (in), SWDIO (bidir), UART_RX_CLI (in), UART_TX_CLI (out), WIFI_STATUS_LED (in)

### Nets
GND: B1.3 B1.4 C10.1 C11.1 C12.1 C13.1 C14.1 TP13.1(PAD) U3.3 U3.5 U3.9 U4.0(GND) U4.1(GND) U4.10(GND) U4.17(GND) U4.20(GND) U4.32(GND) U4.42(GND) U4.51(GND) ; port GND
VSAMW25: C10.2 C11.2 R11.2 TP12.1(PAD) U3.1 U4.7(VBAT) U4.21(VCC) ; port MCU_VCC  [project net 3V3]
ACC_MODE_SEL: U4.27(PB02) ; port ACC_MODE_SEL
ADC_1_THUMBSTICK: U4.35(PA05) ; port ADC_1_THUMB
ADC_2_THUMBSTICK: U4.34(PA04) ; port ADC_2_THUMB
FLASH_MEM_SPI_SS: U4.37(PA07) ; port FLASH_MEM_SS
MCU_LED: U4.16(PA23/Host_SPI_MOSI) ; port MCU_LED
MCU_RESET: C12.2 R11.1 R12.2 TP16.1(PAD) U3.10 U4.24(RESETN_Host) ; port RESET
ON/OFF_BUTTON: U4.36(PA06) ; port ON/OFF BUTTON
PWM: U4.18(PA24/Host_SPI_SSN) ; port BUZZER_PWM
SERCOM0_I2C_SCL: U4.39(PA09) ; port ACC_I2C_SCL  [project net ACC_I2C_SCL]
SERCOM0_I2C_SDA: U4.38(PA08) ; port ACC_I2C_SDA  [project net ACC_I2C_SDA]
SERCOM1_PAD2_SPI_MISO: U4.8(PA16) ; port FLASH_MEM_MISO
SERCOM1_PAD2_SPI_MOSI: U4.11(PA18) ; port FLASH_MEM_MOSI
SERCOM1_PAD3_SPI_SCK: U4.12(PA19) ; port FLASH_MEM_CLK
SERCOM3_I2C_SCL: U4.9(PA17) ; port KEYPAD_I2C_SCL  [project net KEYPAD_I2C_SCL]
SERCOM3_I2C_SDA: U4.15(PA22/Host_SPI_MISO) ; port KEYPAD_I2C_SDA  [project net KEYPAD_I2C_SDA]
SERCOM4_UART_RX_CLI: U4.44(PB11) ; port UART_RX_CLI  [project net MCU_RX_UART_CLI]
SERCOM4_UART_TX_CLI: U4.43(PB10) ; port UART_TX_CLI  [project net MCU_TX_UART_CLI]
SPARE_1: U4.19(PA25/Host_SPI_SCK) ; port SPARE_1
SPARE_2: U4.22(PB22) ; port SPARE_2
SPARE_3: U4.28(PB03) ; port SPARE_3
STATUS_LED: U4.33(PA03) ; port STATUS_LED
SWCLK: TP15.1(PAD) U3.4 U4.25(PA30_/_SWDCLK) ; port SWCLK
SWDIO: TP14.1(PAD) U3.2 U4.26(PA31_/_SWDIO) ; port SWDIO
WIFI_STATUS_LED: U4.31(PA02) ; port WIFI_STATUS_LED
XIN_32: C13.2 U4.29(PA00_/_XIN32) X1.1(X1)
XOUT_32: C14.2 U4.30(PA01_/_XOUT32) X1.2(X2)
NetB1_1: B1.1 B1.2 R12.1

Not connected (* = marked no-connect by the designer): U3 6* 7* 8*; U4 2(UART_TXD)* 3(UART_RXD)* 4(CHIP_EN)* 5(GPIO_1)* 6(GPIO_NC/3)* 13(PA20/Host_UART_RXD)* 14(PA21/Host_UART_TXD)* 23(PB23)* 40(PA10) 41(PA11) 45(GPIO_15/4) 46(GPIO_16/5) 47(GPIO_18/6) 48(I2C_SCL)* 49(I2C_SDA)* 50(RESETN_WIFI)*

### Notes on the sheet
- (near TP12) DEBUGGER PORT
- Calculation of crystal load capacitors:
  Cext = 2x ( Ccrystal - Cpara - Cpcb )
  Ccrystal = 12.5pF (from crystal datasheet)
  Cpara = 3.15pF (from MCU datasheet)
  Cpcb = 0.5pF (estimate)
  Cext = 2x(12.5pF - 3.15pF - 0.5pF) = 17.7pF
- DWG. NO.
- REV.
- SHT.
- THIS DOCUMENT AND THE DATA DISCLOSED HEREIN OR HEREWITH IS THE PROPERTY OF ALTIUM LIMITED AND MAY BE FREELY DISTRIBUTED IN WHOLE. NO RIGHTS ARE RESERVED OR EXPRESS OR IMPLIED WARANTEE GIVEN.
- REVISION
- DESCRIPTION
- DATE
- APPROVED
- ENG:
- APPROVALS
- PROJECT
- DSN:
- CHK:
- REFERENCE DOCUMENTS
- PROJECT REVISION:
- TITLE
- DOCUMENT REVISION:
- DESIGN ITEM:
- BOM:
- FAB DWG:
- PCB DWG:
- ASSY DWG:
- SCALE:
- SIZE
- B
- CAGE CODE
- FILE NAME
- DWG NO.
- SHEET
- OF
- REV

### Library data of the parts
B1 = PTS810 SJK 250 SMTR LFS: as B3 on sheet MAIN; Manufacturer Part Number: PTS810SJK250SMTRLFS; Product Category: Tactile Switches; RoHS: Details; Termination Style: J Form Lead; Mounting Style: SMD/SMT; Color: White; Packaging: Reel; Contact Plating: Silver; Operating Temperature Range: - 40 C to + 85 C; Series: PTS810; Factory Pack Quantity: 2900; ComponentLink1URL: https://datasheet.ciiva.com/18514/pts810-4mar13-18514061.pdf; ComponentLink1Description: https://datasheet.ciiva.com/18514/pts810-4mar13-18514061.pdf; ComponentLink2URL: https://datasheet.ciiva.com/18514/pts810-4mar13-18514062.pdf; ComponentLink2Description: https://datasheet.ciiva.com/18514/pts810-4mar13-18514062.pdf; ComponentLink3URL: https://datasheet.ciiva.com/18514/pts810-4mar13-18514063.pdf; ComponentLink3Description: https://datasheet.ciiva.com/18514/pts810-4mar13-18514063.pdf; Supplier 1: Digi-Key; Supplier Part Number 1: CKN10503CT-ND
C10 C11 = CMP-1036-04927-1: CAP 10uF 16V ±10% 0805 (2012 Metric) Thickness 1.45mm SMD; Case-EIA: 0805; Tolerance: Â±10%; Case-Metric: 2012; Rated Voltage: 16 V; Technology: SMT; Value: 10uF; Max Thickness: 1.45 mm
C12 = CMP-1035-02736-1: as C18 on sheet MAIN; Technology: SMT; Max Thickness: 1 mm; Rated Voltage: 16 V; Value: 1uF
C13 C14 = CMP-1035-00738-1: CAP 18pF 16V ±5% 0603 (1608 Metric) Thickness 1mm SMD; Tolerance: Â±5%; Case-EIA: 0603; Case-Metric: 1608; Max Thickness: 1 mm; Rated Voltage: 16 V; Value: 18pF; Technology: SMT
R11 = CMP-1012-00623-1: as R17 on sheet MAIN; Power: 0.1 W; Tolerance: 1 %; Technology: SMT
R12 = CMP-1012-00397-1: as R35 on sheet MAIN; Technology: SMT; Tolerance: 1 %; Power: 0.1 W
TP12-TP16 = 0.1" Pad-A.4
U3 = 20021111-00010T4LF: CONN HEADER 10POS UNSHD VERT T/H; Manufacturer: Amphenol / FCI; Stack Height: 2.5 mm; Number of Positions / Contacts: 10; Brand: FCI; Pitch: 1.27 mm; Mounting Angle: Vertical; Current Rating: 10 A; Mating Post Length: 3.05 mm; Voltage Rating: 125 V; Manufacturer Part Number: 20021111-00010T4LF; Mounting Style: Through Hole; Product Category: Headers & Wire Housings; RoHS: Details; Series: Minitek; Product Type: Headers; Type: Unshrouded; Number of Positions: 10; Number of Rows: 2; Contact Plating: Gold; Housing Material: Plastic; Termination Style: Through Hole; Contact Material: Nickel; Packaging: Tube; Factory Pack Quantity: 93; Termination Post Length: 2.3 mm; ComponentLink1URL: https://datasheet.ciiva.com/1433/1079612-1433267.pdf; ComponentLink1Description: https://datasheet.ciiva.com/1433/1079612-1433267.pdf; ComponentLink2URL: https://datasheet.ciiva.com/409/20021111-409158.pdf; ComponentLink2Description: https://datasheet.ciiva.com/409/20021111-409158.pdf; ComponentLink3URL: https://datasheet.ciiva.com/5131/20021111-5131386.pdf; ComponentLink3Description: https://datasheet.ciiva.com/5131/20021111-5131386.pdf; ComponentLink4URL: https://datasheet.ciiva.com/9465/20021111-9465402.pdf; ComponentLink4Description: https://datasheet.ciiva.com/9465/20021111-9465402.pdf; Supplier 1: Digi-Key
U4 = SAMW25H18-MR510PB: RF TXRX MODULE WIFI TRACE ANT; Manufacturer: Atmel; Manufacturer Part Number: ATSAMW25H18-MR510PB; Protocol: 802.11b/g/n; Frequency: 2.4GHz; Data Rate: 65Mbps; Power - Output: 17dBm; Sensitivity: -95.5dBm; Serial Interfaces: SPI, UART; Antenna Type: Integrated, Trace; Memory Size: 256kB Flash, 32kB SRAM; Voltage - Supply: 2.7 V ~ 4.2 V; Category: RF/IF and RFID; Family: RF Transceiver Modules; Series: Xplained Pro; Packaging: Tray; RF Family/Standard: WiFi; Modulation: -; Current - Receiving: -; Current - Transmitting: -; Mounting Type: Surface Mount; Operating Temperature: -40°C ~ 85°C; Package / Case: Module; ComponentLink1URL: http://www.atmel.com/devices/ATSAMW25.aspx; ComponentLink1Description: http://www.atmel.com/devices/ATSAMW25.aspx; ComponentLink2URL: http://www.farnell.com/datasheets/1965115.pdf; ComponentLink2Description: http://www.farnell.com/datasheets/1965115.pdf; Supplier 1: Digikey; Stock 1: 120; Pricing 1: 1=19.14 (USD); Supplier Part Number 1: ATSAMW25H18-MR510PB-ND
X1 = CMP-0447-00001-2: Crystal, 32.768 kHz, 12.5 pF, -40 to 85 degC, SMD Low Profile 3.2 x 1.5 x 0.9 mm, Tape and Reel; Manufacturer: Abracon; Q Value (Type): 30000; Operation Mode: Flexural Mode (Tuning Fork); Shunt Capacitance (C0): 0.9 to 1.2 pF; Load Capacitance (CL): 12.5 pF; Frequency Tolerance @+25degC: +/- 20 ppm; Drive Level (Type): 0.1 uW; Equivalent Series Resistance (R1): 70 Kohm; Insulation Resistance (Min): 500 Mohm; ComponentLink3URL: http://www.abracon.com/Resonators/ABS07.pdf; PackageDescription: 2-Pin Hand Drawn, Body 3.2x1.5mm, Pitch 2.5mm; Operating Temperature: -40 to 85 degC; ComponentLink2URL: http://www.abracon.com/Resonators/ABS07.pdf; PackageReference: ABS07-2; ComponentLink3Description: Package Specification; ComponentLink1Description: Manufacturer URL; DatasheetVersion: 04.03.13; Mounting Technology: Surface Mount; ComponentLink2Description: Datasheet; ComponentLink1URL: http://www.abracon.com/; PartNumber: ABS07-32.768KHz-T; Packing: Tape and Reel; Frequency: 32.768 kHz

## Sheet Memory.SchDoc: Shipwars Memory Schematic
size 431 x 279 mm; CheckedBy: SP, PS; Author: SP, PS; CompanyName: UPenn; DrawnBy: SP, PS; Engineer: SP, PS; Organization: UPenn; Address1: 200 S 33rd Street; Address2: Detkin Lab; Address3: Philadelphia; Address4: PA 19104; Revision: .1.0.0; SheetNumber: 2; SheetTotal: 10; Project: Shipwars
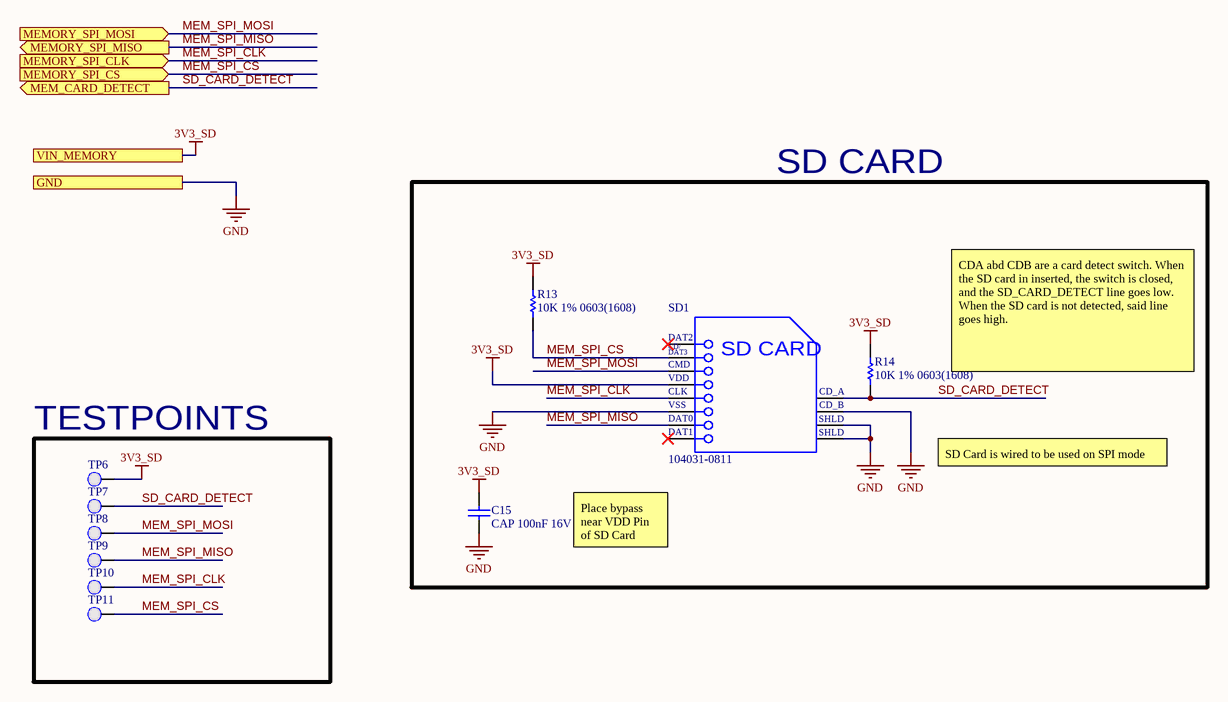
[diagram p3: Memory.SchDoc]

### Parts
C15  CAP 100nF 16V 0603(1608)  [CAPC0603(1608)100_N]
R13  10K 1% 0603(1608)  [RESC0603(1608)_N]
R14  10K 1% 0603(1608)  [RESC0603(1608)_N]
SD1  104031-0811  [MOLX-104031-0811_V]
TP6  0.1" Pad  [PCBComponent]  (value not drawn)  (no BOM)
TP7  0.1" Pad  [PCBComponent]  (value not drawn)  (no BOM)
TP8  0.1" Pad  [PCBComponent]  (value not drawn)  (no BOM)
TP9  0.1" Pad  [PCBComponent]  (value not drawn)  (no BOM)
TP10  0.1" Pad  [PCBComponent]  (value not drawn)  (no BOM)
TP11  0.1" Pad  [PCBComponent]  (value not drawn)  (no BOM)

### Blocks framed on the sheet
SD CARD: C15 R13 R14 SD1
TESTPOINTS: TP6-TP11

### Ports
GND, MEM_CARD_DETECT (out), MEMORY_SPI_CLK (in), MEMORY_SPI_CS (in), MEMORY_SPI_MISO (out), MEMORY_SPI_MOSI (in), VIN_MEMORY

### Nets
3V3_SD: C15.2 R13.2 R14.2 SD1.4(VDD) TP6.1(PAD) ; port VIN_MEMORY  [project net 3V3]
GND: C15.1 SD1.6(VSS2) SD1.10(CD_B) SD1.11(SHLD1) SD1.12(SHLD2) ; port GND
MEM_SPI_CLK: SD1.5(CLK) TP10.1(PAD) ; port MEMORY_SPI_CLK
MEM_SPI_CS: R13.1 SD1.2(CMD) TP11.1(PAD) ; port MEMORY_SPI_CS  [project net FLASH_MEM_SPI_SS]
MEM_SPI_MISO: SD1.7(DAT0) TP9.1(PAD) ; port MEMORY_SPI_MISO
MEM_SPI_MOSI: SD1.3(VSS1) TP8.1(PAD) ; port MEMORY_SPI_MOSI
SD_CARD_DETECT: R14.1 SD1.9(CD_A) TP7.1(PAD) ; port MEM_CARD_DETECT

Not connected (* = marked no-connect by the designer): SD1 1(CD/DAT3)* 8(DAT1)*

### Notes on the sheet
- CDA abd CDB are a card detect switch. When the SD card in inserted, the switch is closed, and the SD_CARD_DETECT line goes low. When the SD card is not detected, said line goes high.
- SD Card is wired to be used on SPI mode
- Place bypass near VDD Pin of SD Card
- DWG. NO.
- REV.
- SHT.
- THIS DOCUMENT AND THE DATA DISCLOSED HEREIN OR HEREWITH IS THE PROPERTY OF ALTIUM LIMITED AND MAY BE FREELY DISTRIBUTED IN WHOLE. NO RIGHTS ARE RESERVED OR EXPRESS OR IMPLIED WARANTEE GIVEN.
- REVISION
- DESCRIPTION
- DATE
- APPROVED
- ENG:
- APPROVALS
- PROJECT
- DSN:
- CHK:
- REFERENCE DOCUMENTS
- PROJECT REVISION:
- TITLE
- DOCUMENT REVISION:
- DESIGN ITEM:
- BOM:
- FAB DWG:
- PCB DWG:
- ASSY DWG:
- SCALE:
- SIZE
- B
- CAGE CODE
- FILE NAME
- DWG NO.
- SHEET
- OF
- REV
- (in symbol CMP-2000-05825-1) DAT2; CD/; DAT3; SD CARD; VSS; SHLD

### Library data of the parts
C15 = CMP-1035-02584-1: as C1 on sheet FTDI; Technology: SMT; Max Thickness: 1 mm; Value: 100nF; Rated Voltage: 16 V
R13 R14 = CMP-1012-00623-1: as R17 on sheet MAIN; Power: 0.1 W; Tolerance: 1 %; Technology: SMT
SD1 = CMP-2000-05825-1: Micro SD Card, RA, -25 to 85 degC, 8-Pin SMD, RoHS, Tape and Reel; Voltage Rating: 10VAC/DC; Number of Contacts: 8; Insertion - Extraction Style: Push-Pull; Pitch: 1.1mm; Mating Cycles: 10000; Brand: Molex; Current Rating: 500mA; Manufacturer URL: http://www.molex.com/; Card Type: microSD; Mounting Type: Standard; Height: 1.42mm; Mounting Technology: SurfaceMount; Contact Plating: Gold; Product Category: MemoryCardConnectors; Package Description: 8-Pin Surface Mount Device, Body 11.95 x 11.4 mm, Pitch 1.1 mm; Datasheet URL: http://www.molex.com/pdm_docs/sd/1040310811_sd.pdf; Termination Style: SMD; Length: 11.4mm; Housing Material: LiquidCrystalPolymer(LCP); Orientation: RightAngle; RoHS: True; Contact Material: PhosphorBronze; Datasheet Version: Rev. E, 04/2006; Packaging: Reel; Manufacturer: Molex; Series: 104031; Product: CardConnectors; Number of Rows: 1Row; Package Reference: 104031-0811
TP6-TP11 = 0.1" Pad-A.4

## Sheet LiPo_Charger.SchDoc: Shipwars Charger Shematic
size 431 x 279 mm; CheckedBy: SP, PS; Author: SP, PS; CompanyName: UPenn; DrawnBy: SP, PS; Engineer: SP, PS; Organization: UPenn; Address1: 200 S 33rd Street; Address2: Detkin Lab; Address3: Philadelphia; Address4: PA 19104; Revision: .1.0.0; SheetNumber: 5; SheetTotal: 10; Project: Shipwars
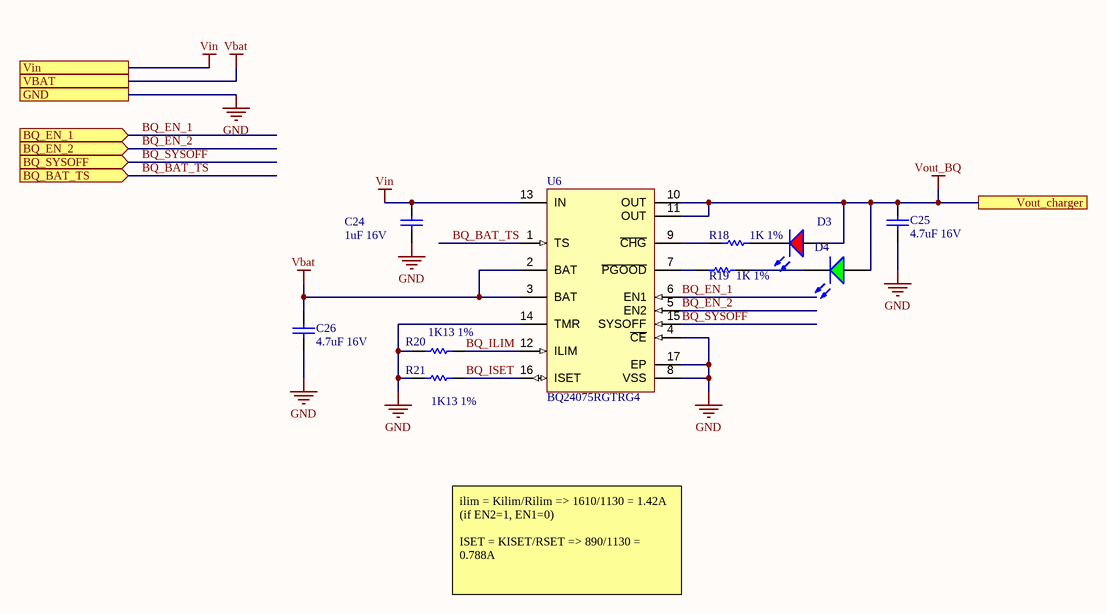
[diagram p4: LiPo_Charger.SchDoc]

### Parts
C24  1uF 16V  [CAPC0603(1608)100_N]
C25  4.7uF 16V  [CAPC0805(2012)145_N]
C26  4.7uF 16V  [CAPC0805(2012)145_N]
D3  LTST-C170CKT  [LTST-C170CKT_V]  (value not drawn)
D4  LTST-C170GKT  [LTST-C170GKT_V]  (value not drawn)
R18  1K 1%  [RESC0603(1608)_N]
R19  1K 1%  [RESC0603(1608)_N]
R20  1K13 1%  [RESC0603(1608)_N]
R21  1K13 1%  [RESC0603(1608)_N]
U6  BQ24075RGTRG4  [RGT16-1700X1700TP]

### Ports
BQ_BAT_TS (in), BQ_EN_1 (in), BQ_EN_2 (in), BQ_SYSOFF (in), GND, VBAT, Vin, Vout_charger

### Nets
GND: C24.1 C25.1 C26.2 R20.1 R21.1 U6.4(~{CE}) U6.5(EN2) U6.8(VSS) U6.14(TMR) U6.15(SYSOFF) U6.17(EP) ; port BQ_EN_2, port BQ_SYSOFF, port GND  [also labelled BQ_EN_2, BQ_SYSOFF]
VBAT: C26.1 U6.2(BAT) U6.3(BAT) ; port VBAT
Vin: C24.2 U6.13(IN) ; port Vin  [project net VUSB]
Vout_BQ: C25.2 D3.1(A) D4.1(A) U6.6(EN1) U6.10(OUT) U6.11(OUT) ; port BQ_EN_1, port Vout_charger  [also labelled BQ_EN_1]
BQ_BAT_TS: U6.1(TS) ; port BQ_BAT_TS
BQ_ILIM: R20.2 U6.12(ILIM)
BQ_ISET: R21.2 U6.16(ISET)
NetD3_2: D3.2(K) R18.2
NetD4_2: D4.2(K) R19.2
NetR18_1: R18.1 U6.9(~{CHG})
NetR19_1: R19.1 U6.7(~{PGOOD})

### Notes on the sheet
- ilim = Kilim/Rilim => 1610/1130 = 1.42A (if EN2=1, EN1=0)
  ISET = KISET/RSET => 890/1130 = 0.788A
- DWG. NO.
- REV.
- SHT.
- THIS DOCUMENT AND THE DATA DISCLOSED HEREIN OR HEREWITH IS THE PROPERTY OF ALTIUM LIMITED AND MAY BE FREELY DISTRIBUTED IN WHOLE. NO RIGHTS ARE RESERVED OR EXPRESS OR IMPLIED WARANTEE GIVEN.
- REVISION
- DESCRIPTION
- DATE
- APPROVED
- ENG:
- APPROVALS
- PROJECT
- DSN:
- CHK:
- REFERENCE DOCUMENTS
- PROJECT REVISION:
- TITLE
- DOCUMENT REVISION:
- DESIGN ITEM:
- BOM:
- FAB DWG:
- PCB DWG:
- ASSY DWG:
- SCALE:
- SIZE
- B
- CAGE CODE
- FILE NAME
- DWG NO.
- SHEET
- OF
- REV

### Library data of the parts
C24 = CMP-1035-02736-1: as C18 on sheet MAIN; Technology: SMT; Max Thickness: 1 mm; Rated Voltage: 16 V; Value: 1uF
C25 C26 = CMP-1036-04893-1: as C4 on sheet FTDI; Max Thickness: 1.45 mm; Value: 4.7uF; Rated Voltage: 16 V; Tolerance: -20% to +80%; Technology: SMT
D3 = CMP-1674-00001-5: as DS3 on sheet MAIN; PackageReference: C170CKT; ComponentLink1Description: Manufacturer URL; ComponentLink1URL: http://www.us.liteon.com/; Package Quantity: 3000; Packaging: Tape and Reel; Pins: 2; ComponentLink2URL: http://media.digikey.com/pdf/Data%20Sheets/Lite-On%20PDFs/LTST-C170CKT.pdf; Max Operating Temperature: 85 degC; Min Operating Temperature: -55 degC; Mounting Technology: Surface Mount; Mount: Surface Mount; Length: 2 mm; ComponentLink2Description: Datasheet; DatasheetVersion: 03/2003; Height: 1.1 mm; PackageDescription: 2-Pin Surface Mount Device, Body 2 x 1.25 mm; RoHSCompliant: true; Colour: Red
D4 = CMP-1674-00002-5: as DS1 on sheet MAIN; PackageReference: C170GKT; ComponentLink1Description: Manufacturer URL; ComponentLink1URL: http://www.us.liteon.com/; Height: 1.1 mm; PackageDescription: 2-Pin Surface Mount Device, Body 2 x 1.25 mm; RoHSCompliant: true; Package Quantity: 1; Packaging: Tape and Reel; Mount: Surface Mount; Min Operating Temperature: -55 degC; DatasheetVersion: 03/2003; Max Operating Temperature: 85 degC; Pins: 2; Mounting Technology: Surface Mount; Length: 2 mm; Colour: Green; ComponentLink2URL: http://media.digikey.com/pdf/Data%20Sheets/Lite-On%20PDFs/LTST-C170GKT.pdf; ComponentLink2Description: Datasheet
R18 R19 = CMP-1012-00510-1: as R6 on sheet MAIN; Technology: SMT; Tolerance: 1 %; Power: 0.1 W
R20 R21 = CMP-1012-00515-1: 1K13 0.1W 1% 0603 (1608 Metric)  SMD; Value: 1130.00 Ohm; Case-EIA: 0603; Case-Metric: 1608; Power: 0.1 W; Tolerance: 1 %; Technology: SMT
U6 = CMP-0321-00237-1: USB-Friendly Li-Ion Battery Charger and Power-Path Management IC, Vout 5.5 V, 4.3 V, -40 to 85 degC, 16-pin QFN (RGT), Green (RoHS & no Sb/Br); Manufacturer: Texas Instruments; Li-Ion: N; SubFamily: Battery Charge Management; Vin(Min)(V): 4.3; ComponentLink1URL: http://www.ti.com/general/docs/lit/getliterature.tsp?genericPartNumber=BQ24075&fileType=pdf; Over Voltage Protection: N; PackageDescription: 16-Pin Plastic Quad Flat No-Lead, 3 x 3 mm Body, 0.5 mm Pitch, 1.7 x 1.7 mm Exposed Pad; NiMH: N; Li-Polymer: N; Eco-Plan: Green (RoHS & no Sb/Br); Code_JEDEC: MO-220; Lead Acid: N; PartNumber: BQ24075RGTRG4; ComponentLink1Description: Datasheet; Mounting Technology: Surface Mount; PackageVersion: revH, Oct-2011; PackageReference: RGT16-1700X1700TP; NiCd: N; DatasheetVersion: SLUS810G